# Altium schematic sheet Sheet3.SchDoc
size A4; SheetNumber: 3; SheetTotal: 3
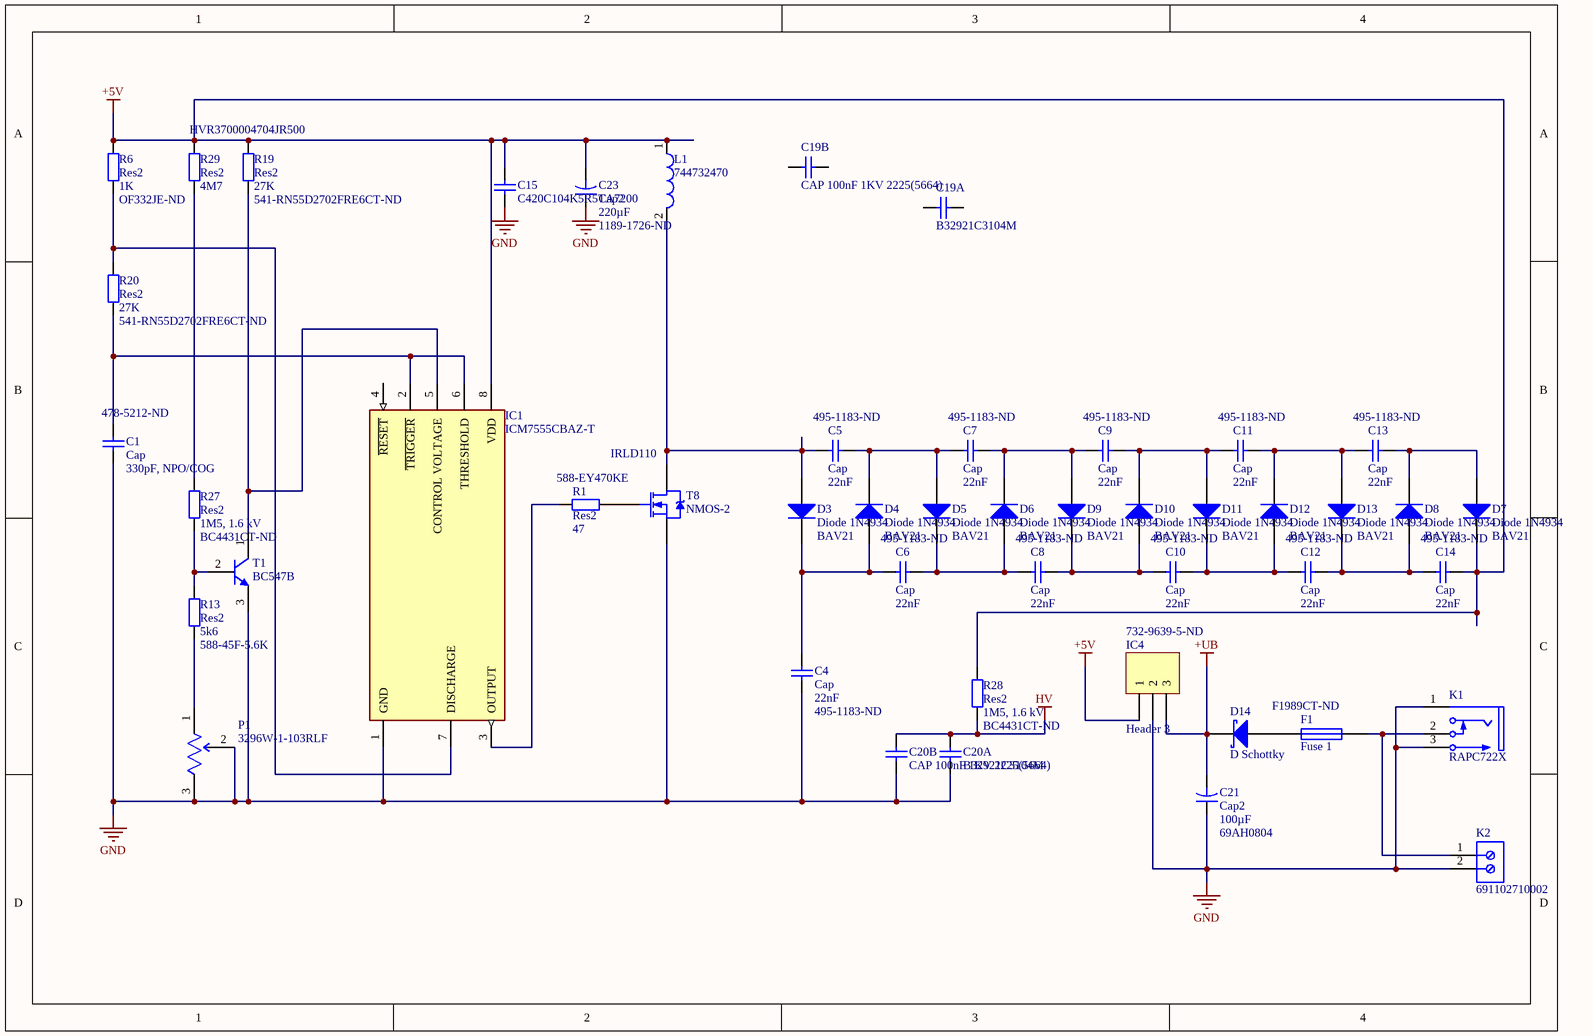
[diagram p0: Sheet3.SchDoc]

## Parts
C1  Cap  value 330pF, NPO/COG  Supplier Part Number 1: 478-5212-ND  [RAD-0.3]
C4  Cap  value 22nF  Supplier Part Number 1: 495-1183-ND  [RAD-0.3]
C5  Cap  value 22nF  Supplier Part Number 1: 495-1183-ND  [RAD-0.3]
C6  Cap  value 22nF  Supplier Part Number 1: 495-1183-ND  [RAD-0.3]
C7  Cap  value 22nF  Supplier Part Number 1: 495-1183-ND  [RAD-0.3]
C8  Cap  value 22nF  Supplier Part Number 1: 495-1183-ND  [RAD-0.3]
C9  Cap  value 22nF  Supplier Part Number 1: 495-1183-ND  [RAD-0.3]
C10  Cap  value 22nF  Supplier Part Number 1: 495-1183-ND  [RAD-0.3]
C11  Cap  value 22nF  Supplier Part Number 1: 495-1183-ND  [RAD-0.3]
C12  Cap  value 22nF  Supplier Part Number 1: 495-1183-ND  [RAD-0.3]
C13  Cap  value 22nF  Supplier Part Number 1: 495-1183-ND  [RAD-0.3]
C14  Cap  value 22nF  Supplier Part Number 1: 495-1183-ND  [RAD-0.3]
C15  C420C104K5R5TA7200  [KEMT-C420C104K5R5TA7200-2]
C19A  B32921C3104M  [TDK-B32921C3104M]
C19B  CAP 100nF 1KV 2225(5664)  [CAPC2225(5664)230_L]
C20A  B32921C3104M  [TDK-B32921C3104M]
C20B  CAP 100nF 1KV 2225(5664)  [CAPC2225(5664)230_L]
C21  Cap2  value 100µF  Supplier Part Number 1: 69AH0804  [CAPR5-4X5]
C23  Cap2  value 220µF  Supplier Part Number 1: 1189-1726-ND  [CAPR5-4X5]
D3  Diode 1N4934  Supplier Part Number 1: BAV21  [DO-41]
D4  Diode 1N4934  Supplier Part Number 1: BAV21  [DO-41]
D5  Diode 1N4934  Supplier Part Number 1: BAV21  [DO-41]
D6  Diode 1N4934  Supplier Part Number 1: BAV21  [DO-41]
D7  Diode 1N4934  Supplier Part Number 1: BAV21  [DO-41]
D8  Diode 1N4934  Supplier Part Number 1: BAV21  [DO-41]
D9  Diode 1N4934  Supplier Part Number 1: BAV21  [DO-41]
D10  Diode 1N4934  Supplier Part Number 1: BAV21  [DO-41]
D11  Diode 1N4934  Supplier Part Number 1: BAV21  [DO-41]
D12  Diode 1N4934  Supplier Part Number 1: BAV21  [DO-41]
D13  Diode 1N4934  Supplier Part Number 1: BAV21  [DO-41]
D14  D Schottky  [SMB]
F1  Fuse 1  Supplier Part Number 1: F1989CT-ND  [PIN-W2/E2.8]
IC1  ICM7555CBAZ-T  [FP-M8_15-MFG]
IC4  Header 3  Supplier Part Number 1: 732-9639-5-ND  [HDR1X3]
K1  RAPC722X  [SWITCH-RAPC712X-3_V]
K2  691102710002  [691102710002]
L1  744732470  [WE-TI-LM-STBG]
P1  3296W-1-103RLF  [FP-3296W-MFG]
R1  Res2  value 47  Supplier Part Number 1: 588-EY470KE  [AXIAL-0.4]
R6  Res2  value 1K  Supplier Part Number 1: OF332JE-ND  [AXIAL-0.4]
R13  Res2  value 5k6  Supplier Part Number 1: 588-45F-5.6K  [AXIAL-0.4]
R19  Res2  value 27K  Supplier Part Number 1: 541-RN55D2702FRE6CT-ND  [AXIAL-0.4]
R20  Res2  value 27K  Supplier Part Number 1: 541-RN55D2702FRE6CT-ND  [AXIAL-0.4]
R27  Res2  value 1M5, 1.6 kV  Supplier Part Number 1: BC4431CT-ND  [AXIAL-0.4]
R28  Res2  value 1M5, 1.6 kV  Supplier Part Number 1: BC4431CT-ND  [AXIAL-0.4]
R29  Res2  value 4M7  Supplier Part Number 1: HVR3700004704JR500  [AXIAL-0.4]
T1  BC547B  [ONSC-TO-92-3-29-11]
T8  NMOS-2  Supplier Part Number 1: IRLD110  [TO-220AB]

## Nets
+5V: C14.2 C15.2 C23.2 D7.2(K) IC1.8(VDD) IC4.1 L1.1 R6.1 R19.2 R28.2 R29.2
+UB: C21.2 D14.2(K) IC4.3
GND: C1.1 C4.1 C15.1 C20A.1 C20B.1 C21.1 C23.1 IC1.1(GND) IC4.2 K1.1 K1.3 K2.2 P1.2(WIPER) P1.3(CW) T1.3(E) T8.3(S)
HV: C20A.2 C20B.2 R28.1
NetC1_2: C1.2 IC1.2(~{TRIGGER}) IC1.6(THRESHOLD) R20.1
NetC4_2: C4.2 C6.1 D3.2(K) D4.1(A)
NetC5_1: C5.1 D3.1(A) L1.2 T8.2(D)
NetC5_2: C5.2 C7.1 D4.2(K) D5.1(A)
NetC6_2: C6.2 C8.1 D5.2(K) D6.1(A)
NetC7_2: C7.2 C9.1 D6.2(K) D9.1(A)
NetC8_2: C8.2 C10.1 D9.2(K) D10.1(A)
NetC9_2: C9.2 C11.1 D10.2(K) D11.1(A)
NetC10_2: C10.2 C12.1 D11.2(K) D12.1(A)
NetC11_2: C11.2 C13.1 D12.2(K) D13.1(A)
NetC12_2: C12.2 C14.1 D8.1(A) D13.2(K)
NetC13_2: C13.2 D7.1(A) D8.2(K)
NetD14_1: D14.1(A) F1.1
NetF1_2: F1.2 K1.2 K2.1
NetIC1_3: IC1.3(OUTPUT) R1.1
NetIC1_5: IC1.5(CONTROL_VOLTAGE) R19.1 T1.1(C)
NetIC1_7: IC1.7(DISCHARGE) R6.2 R20.2
NetP1_1: P1.1(CCW) R13.1
NetR1_2: R1.2 T8.1(G)
NetR13_2: R13.2 R27.1 T1.2(B)
NetR27_2: R27.2 R29.1

Not connected (* = marked no-connect by the designer): C19A 1 2; C19B 1 2; IC1 4(~{RESET})

## Library data of the parts
C1 = Cap: Multilayer Ceramic Capacitor, 330 pF, 100 V,  5%, Radial Leaded, C0G / NP0; Manufacturer: Kyocera AVX; Manufacturer Part Number: SR151A331JAR; Capacitance: 330pF; Voltage Rating: 100V; Voltage Rating (DC): 50V; Lead/Base Style: Straight; Temperature Coefficient: 30ppm/°C; Lead Diameter: 0.508mm; Published: 8-Jun-2000; LatestRevisionDate: 17-Jul-2002; LatestRevisionNote: Re-released for DXP Platform.; PackageReference: RAD-0.3; Publisher: Altium Limited; PackageDescription: Radial Cap, Thru-Hole; 2 Leads; 0.3 in Pin Spacing; Supplier 1: Digi-Key; RoHS: Yes; Category: Ceramic Capacitors; Stock 1: 1456; Pricing 1: 1=0,63000, 10=0,44200, 50=0,33420, 100=0,29110, 500=0,21560, 1000=0,18326, 2500=0,17248, 5000=0,16170 (USD); Mount: Through Hole,PCB; Case/Package: Dipped; Number of Pins: 2; Contact Plating: Tin,Matte; Min Operating Temperature: -55°C; Max Operating Temperature: 125°C; Tolerance: 5%; Packaging: Bulk; Dielectric: C0G; Termination: Radial; Package Quantity: 1000; Resistor Type: Ceramic; Voltage: 100V; Length: 3.81mm; Width: 0.1inch; Height: 3.81mm; Lead Pitch: 2.54mm; Thickness: 2.54mm; Depth: 2.54mm; Height - Seated (Max): 0.15inch; Radiation Hardening: No; RoHS Compliant: Yes; Lead Free: Lead Free; REACH SVHC: No SVHC; ComponentLink1URL: https://datasheet.ciiva.com/11787/0900766b8064818e-11787697.pdf?src-supplier=RSComponents; ComponentLink1Description: https://datasheet.ciiva.com/11787/0900766b8064818e-11787697.pdf?src-supplier=RSComponents; ComponentLink2URL: https://datasheet.ciiva.com/27051/1129391-27051478.pdf?src-supplier=Jameco; ComponentLink2Description: https://datasheet.ciiva.com/27051/1129391-27051478.pdf?src-supplier=Jameco; ComponentLink3URL: https://datasheet.ciiva.com/154/skycap-154577.pdf?src-supplier=Digi-Key; ComponentLink3Description: https://datasheet.ciiva.com/154/skycap-154577.pdf?src-supplier=Digi-Key; ComponentLink4URL: https://datasheet.ciiva.com/16391/skycap-sr-16391048.pdf?src-supplier=Future+Electronics; ComponentLink4Description: https://datasheet.ciiva.com/16391/skycap-sr-16391048.pdf?src-supplier=Future+Electronics; ComponentLink5URL: https://datasheet.ciiva.com/14587/70195658-14587500.pdf?src-supplier=Allied+Electronics; ComponentLink5Description: https://datasheet.ciiva.com/14587/70195658-14587500.pdf?src-supplier=Allied+Electronics; ComponentLink6URL: https://datasheet.ciiva.com/22620/210648-22620069.pdf?src-supplier=Element14; ComponentLink6Description: https://datasheet.ciiva.com/22620/210648-22620069.pdf?src-supplier=Element14; ComponentLink7URL: https://datasheet.ciiva.com/5389/skycap-sr-8826-5389254.pdf?src-supplier=Mouser; ComponentLink7Description: https://datasheet.ciiva.com/5389/skycap-sr-8826-5389254.pdf?src-supplier=Mouser
C4-C14 = Cap: Cap Film 0.022uF 250V PET 5% (7.2 X 2.5 X 6.5mm) Radial 5mm 125C Bulk; Manufacturer: TDK EPCOS; Manufacturer Part Number: B32529C3223J000; Lead Diameter: 0.5mm; Published: 8-Jun-2000; LatestRevisionDate: 17-Jul-2002; LatestRevisionNote: Re-released for DXP Platform.; PackageReference: RAD-0.3; Publisher: Altium Limited; PackageDescription: Radial Cap, Thru-Hole; 2 Leads; 0.3 in Pin Spacing; Supplier 1: Digi-Key; RoHS: Yes; Category: Film Capacitors; Stock 1: 7997; Pricing 1: 1=0,30000, 10=0,21000, 50=0,14720, 100=0,12610, 500=0,09460, 1000=0,07988, 2500=0,07568, 5000=0,07147 (USD); Mount: Through Hole; Case/Package: Radial; Contact Plating: Tin,Matte; Min Operating Temperature: -55°C; Max Operating Temperature: 125°C; Packaging: Bulk; Tolerance: 5%; Capacitance: 22nF; Dielectric: PET; Termination: Radial; Length: 7.2mm; Depth: 2.5mm; Lead Pitch: 5mm; RoHS Compliant: Yes; ComponentLink1URL: http://components.arrow.com/part/dataview/0323_02076122?src-supplier=Arrow+Europe; ComponentLink1Description: http://components.arrow.com/part/dataview/0323_02076122?src-supplier=Arrow+Europe; ComponentLink2URL: https://www.tdk-electronics.tdk.com/inf/20/20/db/fc_2009/B32520_529.pdf?src-supplier=Digi-Key; ComponentLink2Description: https://www.tdk-electronics.tdk.com/inf/20/20/db/fc_2009/B32520_529.pdf?src-supplier=Digi-Key; ComponentLink3URL: http://www.epcos.com/inf/20/20/db/fc_2009/MKT_B32520_529.pdf?src-supplier=Avnet; ComponentLink3Description: http://www.epcos.com/inf/20/20/db/fc_2009/MKT_B32520_529.pdf?src-supplier=Avnet
C15 = CMP-2000-05175-1: CAP, Ceramic, 0.1 uF, +/- 10%, 50 V, -55 to 125 degC, 2-Pin THD, RoHS, Tape and Reel; Manufacturer: KEMET; Capacitance Value: 0.1uF; Dielectric: X7R; Product Diameter: 2.54(Max)mm; Rad Hard: No; Product Length: 6.6(Max)mm; Voltage: 50Vdc; Tolerance: 10%; Package Description: 3-Pin Through Hole Device, Body 7.36 x 2.54 mm, Pitch 11.04 mm; Category: CapacitorCeramicMultilayer; Operating Temperature: -55to125degC; Termination Style: Axial; Manufacturer URL: http://www.kemet.com/; Mounting: ThroughHole; Datasheet URL: http://www.mouser.com/ds/2/212/Kemet_C410-412-420-364989.pdf; Package/Case: 2.54(Max)X6.6(Max); Datasheet Version: Aug-14
C19A C20A = CMP-2000-05890-1: EMI Suppression Capacitor (MKP), 0.1 uF, +/- 20%, 305 V, 2-Pin THD, RoHS, Bulk; Manufacturer: TDK; PCN Packaging: MKT,MKPTypeLaserMarking26/Apr/2013; Online Catalog: B32921C/D-B32928C/DSeries; Featured Product: FilmCapacitors; Product Training Modules: FilmCapacitorsCapacitorsforLEDApplicationsAutomotiveIndustryCapacitors; Catalog Drawings: Y(1,2),X(1,2)SeriesSide1Y(1,2),X(1,2)SeriesSide2; PCN Design/Specification: B32(5679)B333Series02/May/2014; Other Names: 495-2318B32921C3104M000B32921C3104MN1; Capacitance: 0.1µF; Voltage Rating - AC: 305V; Dielectric Material: Polypropylene(PP); Datasheet URL: https://en.tdk.eu/inf/20/20/db/fc_2009/X2_B32921_928.pdf; Package / Case: Radial; Operating Temperature: -40°C~110°C; Lead Spacing: 0.394"(10.00mm); Size / Dimension: 0.512"Lx0.236"W(13.00mmx6.00mm); Package Reference: B32921C3104M; Datasheet Version: 09/2016; Features: X2SafetyRated; Standard Package: 1,000; Category: Capacitors; Package Description: 2-Pin Through Hole Device, Body 13 x 6 mm, Pitch 10 mm; Family: FilmCapacitors; ESR (Equivalent Series Resistance): -; Voltage Rating - DC: -; Termination: PCPins; Packaging: Bulk; Mounting Type: ThroughHole; Height - Seated (Max): 0.472"(12.00mm); Mounting Technology: ThroughHole; Manufacturer URL: http://www.tdk.com/; Applications: EMI,RFISuppression; Tolerance: ±20%; Series: B32921
C19B C20B = CMP-1043-00700-1: CAP 100nF 1KV ±10% 2225 (5664 Metric) Thickness 2.2mm SMD; Tolerance: Â±10%; Case-EIA: 2225; Case-Metric: 5664; Value: 100nF; Max Thickness: 2.2 mm; Technology: SMT; Rated Voltage: 1K V
C21 = Cap2: Cap Aluminum 100uF 25V 20% (6.3 X 11mm) Radial 5mm 190mA 2500 hr 85C Ammo Pack; Manufacturer: Vishay BCcomponents; Manufacturer Part Number: MAL203836101E3; Life (Hours): 2500Hour; Leakage Current: 25uA; Dissipation Factor: 0.14%; Lead Diameter: 0.5mm; Published: 23-Sep-2002; PackageReference: CAPR5-4X5; Publisher: Altium Limited; PackageDescription: Capacitor; 2 Leads; Supplier 1: Newark; RoHS: Yes; Category: Aluminum Electrolytic Capacitors; Stock 1: 9020; Pricing 1: 10=0,22900, 25=0,22100, 50=0,21300, 100=0,20400 (USD); Mount: Through Hole; Case/Package: Radial; Weight: 0.021164oz; Min Operating Temperature: -40°C; Max Operating Temperature: 85°C; Capacitance: 100uF; Tolerance: 20%; Voltage Rating: 25V; Packaging: Tape and Reel; Ripple Current: 190mA; Termination: Radial; Package Quantity: 10000; Voltage Rating (DC): 25V; Series: 038 RSU; Diameter: 6.3mm; Length: 11mm; Height: 11mm; Height - Seated (Max): 0.492inch; Lead Pitch: 5mm; Radiation Hardening: No; RoHS Compliant: Yes; ComponentLink1URL: https://datasheet.ciiva.com/11701/038rsu-11701167.pdf?src-supplier=Avnet; ComponentLink1Description: https://datasheet.ciiva.com/11701/038rsu-11701167.pdf?src-supplier=Avnet
C23 = Cap2: Rubycon Aluminium Electrolytic Capacitor 220F 16 V dc 6.3mm Through Hole series ZLH lifetime 6000h; Manufacturer Part Number: 16ZLH220MEFC6.3X11; Capacitance: 220uF; Tolerance: 20%; Voltage Rating: 16V; Ripple Current: 540mA; Life (Hours): 6000Hour; Leakage Current: 3uA; Impedance: 94mR; Lead Diameter: 0.5mm; Published: 23-Sep-2002; PackageReference: CAPR5-4X5; Publisher: Altium Limited; PackageDescription: Capacitor; 2 Leads; Supplier 1: Digi-Key; Manufacturer: Rubycon; RoHS: Yes; Category: Aluminum Electrolytic Capacitors; Stock 1: 7286; Pricing 1: 1=0,32000, 10=0,21700, 50=0,14480, 100=0,12320, 500=0,08694, 1000=0,07607, 2500=0,07245, 5000=0,06702 (USD); Mount: Through Hole; Case/Package: Radial; Number of Pins: 2; Dielectric Material: Aluminium; Min Operating Temperature: -40°C; Max Operating Temperature: 105°C; Packaging: Bulk; Package Quantity: 2000; Voltage Rating (DC): 16V; Termination: Radial; Series: ZLH; Voltage: 16V; Construction: RADIAL; Ripple Current (AC): 540mA; Diameter: 6.3mm; Height: 11mm; Lead Pitch: 2.5mm; Height - Seated (Max): 0.492inch; Radiation Hardening: No; RoHS Compliant: Yes; REACH SVHC: No SVHC; ComponentLink1URL: https://datasheet.ciiva.com/11778/0900766b80e2f602-11778004.pdf?src-supplier=RSComponents; ComponentLink1Description: https://datasheet.ciiva.com/11778/0900766b80e2f602-11778004.pdf?src-supplier=RSComponents; ComponentLink2URL: https://datasheet.ciiva.com/11692/e-zlh-11692183.pdf?src-supplier=Avnet; ComponentLink2Description: https://datasheet.ciiva.com/11692/e-zlh-11692183.pdf?src-supplier=Avnet; ComponentLink3URL: https://datasheet.ciiva.com/6317/e-zlh-6317161.pdf?src-supplier=Digi-Key; ComponentLink3Description: https://datasheet.ciiva.com/6317/e-zlh-6317161.pdf?src-supplier=Digi-Key; ComponentLink4URL: https://datasheet.ciiva.com/1455/1758712-1455435.pdf?src-supplier=Element14; ComponentLink4Description: https://datasheet.ciiva.com/1455/1758712-1455435.pdf?src-supplier=Element14; ComponentLink5URL: https://datasheet.ciiva.com/17514/e-zlh-17514781.pdf?src-supplier=Avnet+Europe; ComponentLink5Description: https://datasheet.ciiva.com/17514/e-zlh-17514781.pdf?src-supplier=Avnet+Europe
D3-D13 = Diode 1N4934: DIODE, SMALL SIGNAL, DO-35; Manufacturer: NXP Semiconductors; Element Configuration: Single; Reverse Recovery Time: 50ns; Forward Voltage: 1.25V; Max Repetitive Reverse Voltage (Vrrm): 250V; Forward Current: 250mA; Max Forward Surge Current (Ifsm): 1A; Current Rating: 200mA; Polarity: Standard; Capacitance: 5pF; Published: 8-Jun-2000; LatestRevisionDate: 17-Jul-2002; LatestRevisionNote: Re-released for DXP Platform.; DatasheetVersion: 1999; PackageVersion: Aug-1999; PackageReference: DO-41; Publisher: Altium Limited; PackageDescription: Diode, Axial; Body 5.2 x 2.7 mm (LxDia. max), Lead Dia. 0.86 mm (max); Code_JEDEC: DO-204-AL; ComponentLink1Description: Manufacturer Link; ComponentLink1URL: http://www.fairchildsemi.com/; ComponentLink2Description: Datasheet; ComponentLink2URL: http://www.fairchildsemi.com/ds/1N%2F1N4934.pdf; Supplier 1: Avnet; Manufacturer Part Number: BAV21; RoHS: Yes; Category: Rectifier Diodes; Stock 1: 745; Case/Package: DO-204AH; Number of Pins: 2; Max Operating Temperature: 175°C; Packaging: Bulk; Voltage Rating (DC): 250V; Output Current: 200mA; Lead Free: Lead Free; REACH SVHC: No SVHC; RoHS Compliant: Yes
D14 = D Schottky: Schottky Diode; Published: 8-Jun-2000; LatestRevisionDate: 17-Jul-2002; LatestRevisionNote: Re-released for DXP Platform.; PackageReference: SMB; Publisher: Altium Limited; PackageDescription: DO-214-AA/SMB; 2 C-Bend Leads; Body 5.3 x 3.6 mm, inc. leads (LxW); Code_JEDEC: DO-214-AA
F1 = Fuse 1: PTC Resettable Fuse 0.5A(hold) 1A(trip) 60VDC 40A 0.77W 4s 0.5Ohm Radial 7.9 X 3.1mm Ammo Pack; Manufacturer: Littelfuse; Manufacturer Part Number: 60R050XPR; Resistance: 1.17R; Max Voltage Rating (DC): 60V; Power Dissipation: 770mW; Hold Current: 500mA; Approvals: cULus,TUV; Published: 8-Jun-2000; LatestRevisionDate: 17-Jul-2002; LatestRevisionNote: Re-released for DXP Platform.; PackageReference: PIN-W2/E2.8; Publisher: Altium Limited; PackageDescription: Thru-Hole; 2 Leads; Supplier 1: Digi-Key; RoHS: Yes; Category: PTC Resettable Fuses; Stock 1: 1853; Pricing 1: 1=0,53000, 5=0,51400, 10=0,49700, 50=0,41840, 100=0,34740, 250=0,31580, 500=0,26844, 1000=0,23685 (USD); Case/Package: Radial; Min Operating Temperature: -40°C; Max Operating Temperature: 85°C; Current Rating: 40A; Max Current Rating: 40A; Package Quantity: 2000; Packaging: Tape and Reel; Termination: Radial; Working Voltage: 60V; Voltage Rating (DC): 60V; Operating Supply Voltage: 60V; Trip Current: 1A; Time to Trip: 4s; Series: POLY-FUSE®, 60R; Width: 7.62mm; Height: 13.7mm; Lead Pitch: 5.1mm; Thickness: 3.05mm; Size: 3.1mm; REACH SVHC: Unknown; Lead Free: Lead Free; RoHS Compliant: Yes; ComponentLink1URL: https://datasheet.ciiva.com/16393/littelfuse-60r-16393256.pdf?src-supplier=Future+Electronics; ComponentLink1Description: https://datasheet.ciiva.com/16393/littelfuse-60r-16393256.pdf?src-supplier=Future+Electronics; ComponentLink2URL: https://datasheet.ciiva.com/325/littelfuse-60r-325835.pdf?src-supplier=Digi-Key; ComponentLink2Description: https://datasheet.ciiva.com/325/littelfuse-60r-325835.pdf?src-supplier=Digi-Key; ComponentLink3URL: https://datasheet.ciiva.com/325/littelfuse-60r-325836.pdf?src-supplier=Digi-Key; ComponentLink3Description: https://datasheet.ciiva.com/325/littelfuse-60r-325836.pdf?src-supplier=Digi-Key; ComponentLink4URL: https://datasheet.ciiva.com/14119/iewickmann-resettables-rld60-en-14119741.pdf?src-supplier=Distrelec; ComponentLink4Description: https://datasheet.ciiva.com/14119/iewickmann-resettables-rld60-en-14119741.pdf?src-supplier=Distrelec; ComponentLink5URL: https://datasheet.ciiva.com/46430/692303-46430109.pdf?src-supplier=Element14; ComponentLink5Description: https://datasheet.ciiva.com/46430/692303-46430109.pdf?src-supplier=Element14
IC1 = CMP-13501-000001-1: IC OSC SINGLE TIMER 1MHZ 8-SOIC
IC4 = Header 3: WURTH ELEKTRONIK - 173010578 - DC/DC Converter, ITE & General, 1 Output, 5 W, 5 V, 1 A, FDSM Series; Manufacturer: Wurth Electronics; Number of Outputs: 1; Min Input Voltage: 7V; Max Input Voltage: 28V; Voltage - Output 1: 5V; Max Output Current: 1A; Efficiency: 91%; Switching Frequency: 300kHz; Max Power Dissipation: 5W; LatestRevisionDate: 17-Jul-2002; LatestRevisionNote: Re-released for DXP Platform.; Publisher: Altium Limited; Supplier 1: Digi-Key; Manufacturer Part Number: 173010578; RoHS: Yes; Category: Board Mount Modules; Stock 1: 316; Pricing 1: 1=7,36000 (USD); Mount: Through Hole; Case/Package: Module; Number of Pins: 3; Min Operating Temperature: -40°C; Max Operating Temperature: 85°C; Packaging: Rail/Tube; Output Current: 1A; Nominal Output Voltage: 5V; Features: OVP,OCP,OTP,SCP; Length: 0.46inch; Width: 0.33inch; Height: 0.41inch; REACH SVHC: Unknown; RoHS Compliant: Yes; ComponentLink1URL: http://www.farnell.com/datasheets/2061786.pdf?src-supplier=Farnell; ComponentLink1Description: http://www.farnell.com/datasheets/2061786.pdf?src-supplier=Farnell; ComponentLink2URL: http://www.farnell.com/datasheets/2061786.pdf?src-supplier=Element14; ComponentLink2Description: http://www.farnell.com/datasheets/2061786.pdf?src-supplier=Element14; ComponentLink3URL: https://katalog.we-online.de/pm/datasheet/173010578.pdf?src-supplier=Digi-Key; ComponentLink3Description: https://katalog.we-online.de/pm/datasheet/173010578.pdf?src-supplier=Digi-Key; ComponentLink4URL: http://www.farnell.com/datasheets/2061786.pdf?src-supplier=Newark; ComponentLink4Description: http://www.farnell.com/datasheets/2061786.pdf?src-supplier=Newark
K1 = CMP-2000-05384-1: Power Jack, 5 A, 3-Pin THD, RoHS, Bulk; Manufacturer: Switchcraft; Current Rating: 5A; Plug/Mating Plug Diameter: 2.1mmID,5.5mmOD; Gender: Male; Mating Products: S765-ND / -CONNPLUGMINIPWR2CONDWHT/RED / S760K-ND / -CONNPOWERPLUGMINI.08"BLACK / SC1052-ND / -CONNPOWERPLUGMINIBLACK; Number of Positions/Contacts: 2Conductors,2Contacts; Internal Switch(s): SingleSwitch,NormallyClosed; Shielding: Unshielded; Catalog Drawings: RAPC7(1,2)2XSide / RAPC7(1,2)2XTop; Dynamic Catalog: SwitchcraftInc; Other Names: Q2287470A / RAPC722X-ND / SC1313; Standard Package: 2,500; Termination: SolderEyelet(s); Family: Barrel-PowerConnectors; Housing Color: Black; Housing Material: Thermoplastic; RoHS Information: SwitchcraftRoHSInfo; Color: Black; Contact Material - Plating: Nickel; Mounting Type: ThroughHole,RightAngle; Manufacturer URL: http://www.switchcraft.com/; Contact Material: Brass; Datasheet Version: Rev. A, 08/2005; Connector Type: Jack; Category: Connectors,Interconnects; Datasheet URL: http://www.mouser.com/ds/2/393/rapc722x_cd-371352.pdf
K2 = CMP-1502-03258-1: Series 102 - 5.00 mm Horizontal Entry Modular with Pressure Clamp WR-TBL, 2 pin; Manufacturer: Wurth Elektronik; Pin Number: 2; Pitch: 5.00mm; Manufacturer URL: http://www.we-online.de; Mounting Technology: THT; Publisher: WurthElektronik; Packaging: Box; Package Reference: 691102710002; Datasheet URL: http://katalog.we-online.de/em/datasheet/6911027100xx.pdf; Operating Temperature: -40to105degC; Part Number: 691102710002
L1 = CMP-0225-00013-1: Radial Leaded Wire Wound Inductor WE-TI, L = 47.0 µH; Inductance: 47.0 ÂµH; ComponentLink2Description: Datasheet; PackageReference: WE-TI-LM-STBG; PackageVersion: 2010; ComponentLink2URL: http://www.we-online.de/katalog/media/pdf/744732470.pdf; ComponentLink1URL: http://www.we-online.com; DatasheetVersion: ver 2, Jan-2010; PackageDescription: THT Inductor, 2-Leads, Body 9.5 x 9.5 mm; ComponentLink1Description: Manufacturer Link
P1 = CMP-07234-000024-1: TRIMMER 10K OHM 0.5W PC PIN TOP; Resistance: 10kR; Temperature Coefficient: 100ppm/°C; Power Rating: 500mW; Tolerance: 10%; Number of Turns: 25; Width: 0.19inch; Termination: Pin; Radiation Hardening: No; Contact Plating: Tin; Composition: Cermet; Length: 9.53mm; Height: 0.395inch; Depth: 4.83mm; REACH SVHC: No SVHC; Weight: 0.03oz; Min Operating Temperature: -55°C; Military Standard: Not; Max Operating Temperature: 125°C; Packaging: Tape and Reel; Package Quantity: 1; Taper: Linear; Max Power Dissipation: 500mW; Mount: Through Hole
R1 = Res2: RES, CERAMIC, 47OHM, 2.5W, 10%, AXIAL; Product Range:OHMITE - EY Series; Resistance:47ohm; Power Rating:2.5W; Resistance Tolerance:± 10%; Resistor Case Style:Axial Leaded; Resistor Element Material:Ceramic; Temperature ;RoHS Compliant: Yes; Manufacturer: Ohmite; Manufacturer Part Number: EY470KE; Resistance: 47R; Temperature Coefficient: 300ppm/°C; Voltage Rating: 550V; Lead Diameter: 1mm; Published: 8-Jun-2000; LatestRevisionDate: 17-Jul-2002; LatestRevisionNote: Re-released for DXP Platform.; PackageReference: AXIAL-0.4; Publisher: Altium Limited; PackageDescription: Axial Device, Thru-Hole; 2 Leads; 0.4 in Pin Spacing; Supplier 1: Mouser; RoHS: Yes; Category: Through-Hole Resistors; Stock 1: 99; Pricing 1: 1=5,01000, 10=4,47000, 50=3,84000, 100=3,31000, 1000=2,28000, 10000=2,25000 (USD); Mount: Through Hole; Case/Package: Axial; Min Operating Temperature: -40°C; Max Operating Temperature: 110°C; Power Rating: 2.5W; Tolerance: 10%; Resistor Type: Ceramic; Packaging: Bulk; Number of Terminations: 2; Termination: Axial; Package Quantity: 25; Max Power Dissipation: 2.5W; Features: Moisture Resistant; Diameter: 9.4mm; Length: 1.819inch; RoHS Compliant: Yes; REACH SVHC: Unknown; ComponentLink1URL: https://datasheet.ciiva.com/29653/res-ey-29653422.pdf?src-supplier=Digi-Key; ComponentLink1Description: https://datasheet.ciiva.com/29653/res-ey-29653422.pdf?src-supplier=Digi-Key; ComponentLink2URL: https://datasheet.ciiva.com/46422/1812108-46422284.pdf?src-supplier=Element14; ComponentLink2Description: https://datasheet.ciiva.com/46422/1812108-46422284.pdf?src-supplier=Element14; ComponentLink3URL: https://datasheet.ciiva.com/46641/70356302-46641404.pdf?src-supplier=Allied+Electronics; ComponentLink3Description: https://datasheet.ciiva.com/46641/70356302-46641404.pdf?src-supplier=Allied+Electronics; ComponentLink4URL: https://datasheet.ciiva.com/46439/1812108-46439885.pdf?src-supplier=Element14; ComponentLink4Description: https://datasheet.ciiva.com/46439/1812108-46439885.pdf?src-supplier=Element14
R6 = Res2: Resistor;  Carbon Composition;  Res 3.3 Kilohms;  Pwr-Rtg 0.5 W;  Tol 5%;  Axial; Manufacturer: Ohmite; Manufacturer Part Number: OF332JE; Resistance: 3.3kR; Power Rating: 500mW; Voltage Rating: 350V; Lead Diameter: 0.7mm; Lead Length: 34.3mm; Wire/Cable Diameter: 0.029inch; Published: 8-Jun-2000; LatestRevisionDate: 17-Jul-2002; LatestRevisionNote: Re-released for DXP Platform.; PackageReference: AXIAL-0.4; Publisher: Altium Limited; PackageDescription: Axial Device, Thru-Hole; 2 Leads; 0.4 in Pin Spacing; Supplier 1: Digi-Key; RoHS: Yes; Category: Through-Hole Resistors; Stock 1: 864; Pricing 1: 1=0,94000, 10=0,83700, 25=0,76960, 50=0,70200, 100=0,60750, 250=0,51300, 500=0,43200, 1000=0,35910 (USD); Mount: Through Hole; Case/Package: Axial; Number of Pins: 2; Min Operating Temperature: -70°C; Max Operating Temperature: 130°C; Package Quantity: 100; Packaging: Bulk; Tolerance: 5%; Resistor Type: Carbon Composition; Number of Terminations: 2; Termination: Axial; Max Power Dissipation: 500mW; Voltage Rating (DC): 350V; Diameter: 3.8mm; Length: 10.3mm; Lead Pitch: 0.7mm; RoHS Compliant: Yes; REACH SVHC: Unknown; Lead Free: Lead Free; ComponentLink1URL: https://datasheet.ciiva.com/2757/res-od-of-oa-2757185.pdf?src-supplier=Digi-Key; ComponentLink1Description: https://datasheet.ciiva.com/2757/res-od-of-oa-2757185.pdf?src-supplier=Digi-Key; ComponentLink2URL: https://datasheet.ciiva.com/15782/little-demon-15782747.pdf?src-supplier=Onlinecomponents.com; ComponentLink2Description: https://datasheet.ciiva.com/15782/little-demon-15782747.pdf?src-supplier=Onlinecomponents.com; ComponentLink3URL: https://datasheet.ciiva.com/46422/1579394-46422350.pdf?src-supplier=Element14; ComponentLink3Description: https://datasheet.ciiva.com/46422/1579394-46422350.pdf?src-supplier=Element14; ComponentLink4URL: https://datasheet.ciiva.com/16719/70022143-16719455.pdf?src-supplier=Allied+Electronics; ComponentLink4Description: https://datasheet.ciiva.com/16719/70022143-16719455.pdf?src-supplier=Allied+Electronics
R13 = Res2: RES 5.6K OHM 5W 1% AXIAL; Manufacturer: Ohmite; Manufacturer Part Number: 45F5K6; Resistance: 5.6kR; Temperature Coefficient: 20ppm/°C; Voltage Rating: 460V; Published: 8-Jun-2000; LatestRevisionDate: 17-Jul-2002; LatestRevisionNote: Re-released for DXP Platform.; PackageReference: AXIAL-0.4; Publisher: Altium Limited; PackageDescription: Axial Device, Thru-Hole; 2 Leads; 0.4 in Pin Spacing; Supplier 1: Mouser; RoHS: No; Category: Through-Hole Resistors; Stock 1: 75; Pricing 1: 1=2,11000, 10=1,97000, 50=1,67000, 100=1,51000, 1000=0,88900, 10000=0,86200 (USD); Mount: Through Hole; Case/Package: Axial; Min Operating Temperature: 25°C; Max Operating Temperature: 275°C; Tolerance: 1%; Packaging: Bulk; Resistor Type: Wirewound; Number of Terminations: 2; Max Power Dissipation: 5W; Package Quantity: 25; Power Rating: 5W; Termination: Axial; Diameter: 8.7mm; Length: 0.937inch; ComponentLink1URL: https://datasheet.ciiva.com/2760/res-40-2760770.pdf?src-supplier=Digi-Key; ComponentLink1Description: https://datasheet.ciiva.com/2760/res-40-2760770.pdf?src-supplier=Digi-Key; ComponentLink2URL: https://datasheet.ciiva.com/5639/40-series-5639550.pdf?src-supplier=Mouser; ComponentLink2Description: https://datasheet.ciiva.com/5639/40-series-5639550.pdf?src-supplier=Mouser
R19 R20 = Res2: RES 27K OHM 1/8W 1% AXIAL; Manufacturer: Vishay Dale; Manufacturer Part Number: RN55D2702FRE6; Resistance: 27kR; Max Power Dissipation: 125mW; Temperature Coefficient: 100ppm/°C; Voltage Rating: 200V; Lead Diameter: 0.64mm; Published: 8-Jun-2000; LatestRevisionDate: 17-Jul-2002; LatestRevisionNote: Re-released for DXP Platform.; PackageReference: AXIAL-0.4; Publisher: Altium Limited; PackageDescription: Axial Device, Thru-Hole; 2 Leads; 0.4 in Pin Spacing; Supplier 1: Digi-Key; RoHS: No; Category: Through-Hole Resistors; Stock 1: 127; Pricing 1: 1=0,53000, 10=0,40700, 25=0,30960, 50=0,23000, 100=0,17110, 250=0,14456, 500=0,12390 (USD); Case/Package: Axial; Min Operating Temperature: -65°C; Max Operating Temperature: 175°C; Tolerance: 1%; Resistor Type: Metal Film; Packaging: Tape and Reel; Number of Terminations: 2; Package Quantity: 1000; Power Rating: 125mW; Features: Moisture Resistant,Military,Flame Retardant Coating; Series: Military, MIL-R-10509/7, RN55; Termination: Axial; Length: 0.24inch; Width: 2.29mm; RoHS Compliant: No; Lead Free: Contains Lead; ComponentLink1URL: https://datasheet.ciiva.com/14071/cmfmil-14071638.pdf?src-supplier=Digi-Key; ComponentLink1Description: https://datasheet.ciiva.com/14071/cmfmil-14071638.pdf?src-supplier=Digi-Key
R27 R28 = Res2: VISHAY - HVR2500001504JA100 - MOTSTÅND, 1M5; Manufacturer: Vishay BCcomponents; Voltage Rating: 1.6kV; Resistance: 1.5MR; Tolerance: 5%; Power Rating: 250mW; Temperature Coefficient: 250ppm/°C; Lead Length: 26mm; Published: 8-Jun-2000; LatestRevisionDate: 17-Jul-2002; LatestRevisionNote: Re-released for DXP Platform.; PackageReference: AXIAL-0.4; Publisher: Altium Limited; PackageDescription: Axial Device, Thru-Hole; 2 Leads; 0.4 in Pin Spacing; Supplier 1: Digi-Key; Manufacturer Part Number: HVR2500001504JA100; RoHS: Yes; Category: Through-Hole Resistors; Stock 1: 2978; Pricing 1: 1=0,45000, 10=0,32200, 25=0,23760, 50=0,17540, 100=0,12870, 250=0,10632, 500=0,08766 (USD); Case/Package: Conformal; Min Operating Temperature: -55°C; Max Operating Temperature: 155°C; Resistor Type: Metal Film; Termination: Axial; Construction: Cylindrical; Resistance Tolerance: 5%; Length: 7.5mm; REACH SVHC: Unknown; Military Standard: Not; RoHS Compliant: Yes; ComponentLink1URL: http://www.farnell.com/datasheets/2045737.pdf?src-supplier=Farnell; ComponentLink1Description: http://www.farnell.com/datasheets/2045737.pdf?src-supplier=Farnell; ComponentLink2URL: http://components.arrow.com/part/dataview/0323_04158699?src-supplier=Arrow+Europe; ComponentLink2Description: http://components.arrow.com/part/dataview/0323_04158699?src-supplier=Arrow+Europe; ComponentLink3URL: http://www.farnell.com/datasheets/2045737.pdf?src-supplier=Element14; ComponentLink3Description: http://www.farnell.com/datasheets/2045737.pdf?src-supplier=Element14; ComponentLink4URL: http://www.vishay.com/docs/30260/hvr2537.pdf?src-supplier=Digi-Key; ComponentLink4Description: http://www.vishay.com/docs/30260/hvr2537.pdf?src-supplier=Digi-Key; ComponentLink5URL: http://www.farnell.com/datasheets/2045737.pdf?src-supplier=Newark; ComponentLink5Description: http://www.farnell.com/datasheets/2045737.pdf?src-supplier=Newark
R29 = Res2: RES 4.7M OHM 1/2W 5% AXIAL; Manufacturer: Vishay BCcomponents; Resistance: 4.7MR; Max Power Dissipation: 500mW; Temperature Coefficient: 200ppm/°C; Voltage Rating: 3.5kV; Published: 8-Jun-2000; LatestRevisionDate: 17-Jul-2002; LatestRevisionNote: Re-released for DXP Platform.; PackageReference: AXIAL-0.4; Publisher: Altium Limited; PackageDescription: Axial Device, Thru-Hole; 2 Leads; 0.4 in Pin Spacing; Supplier 1: Arrow Electronics; Manufacturer Part Number: HVR3700004704JR500; RoHS: Yes; Category: Through-Hole Resistors; Stock 1: 1607; Pricing 1: 1=0,55200, 10=0,42080, 25=0,31700, 50=0,23310, 100=0,17160, 250=0,14340, 500=0,12170, 1000=0,09170, 5000=0,07430, 1=0,25800, 10=0,19670, 25=0,14820, 100=0,08110, 250=0,08040, 500=0,07960, 1000=0,07890 (USD); Case/Package: Axial; Number of Pins: 2; Min Operating Temperature: -55°C; Max Operating Temperature: 155°C; Tolerance: 5%; Resistor Type: Metal Film; Packaging: Tape and Reel; Number of Terminations: 2; Series: HVR37; Package Quantity: 1; Power Rating: 500mW; Voltage Rating (DC): 3.5kV; Features: Flame Retardant Coating; Resistance Tolerance: 5%; Length: 0.394inch; RoHS Compliant: Yes; REACH SVHC: Unknown; Lead Free: Lead Free; ComponentLink1URL: https://datasheet.ciiva.com/2711/hvr2537-2711956.pdf?src-supplier=Digi-Key; ComponentLink1Description: https://datasheet.ciiva.com/2711/hvr2537-2711956.pdf?src-supplier=Digi-Key; ComponentLink2URL: https://datasheet.ciiva.com/2711/hvr2537-2711957.pdf?src-supplier=Digi-Key; ComponentLink2Description: https://datasheet.ciiva.com/2711/hvr2537-2711957.pdf?src-supplier=Digi-Key; ComponentLink3URL: https://datasheet.ciiva.com/7836/653840-7836134.pdf?src-supplier=Element14; ComponentLink3Description: https://datasheet.ciiva.com/7836/653840-7836134.pdf?src-supplier=Element14
T1 = CMP-1048-01467-1: Amplifier Transistor, NPN Silicon, 3-Pin TO-92, Bulk Box; Manufacturer: On Semiconductor; IC Continuous (A): 0.1; fT Min (MHz): 150; DatasheetVersion: Rev. 7; ComponentLink1URL: http://www.onsemi.com/; Polarity: NPN; RoHS: FALSE; ComponentLink1Description: Manufacturer URL; Packing: Bulk Box; PackageDescription: 3-Pin Transistor Outline, Body 4.825 x 3.685 mm, Pitch 1.27 mm; ComponentLink3URL: http://www.onsemi.cn/pub_link/Collateral/2N6426-D.PDF; ComponentLink2Description: Datasheet; PackageVersion: Rev. AM; PackageReference: TO-92-3-29-11_AM_SL; ComponentLink3Description: Package Specification; Mounting Technology: Through Hole; PartNumber: BC547B; ComponentLink2URL: http://www.onsemi.com/pub_link/Collateral/BC546-D.PDF
T8 = NMOS-2: MOSFET N-CH 100V 1A 4-DIP; Manufacturer: Vishay Siliconix; Note: Pin 2 is electrically connected to pin 4.; Rise Time: 47ns; Max Power Dissipation: 1.3W; Drain to Source Resistance: 540mR; Gate to Source Voltage (Vgs): 10V; Turn-Off Delay Time: 16ns; Turn-On Delay Time: 9.3ns; Input Capacitance: 250pF; Number of Channels: 1; Published: 8-Jun-2000; LatestRevisionDate: 17-Jul-2002; LatestRevisionNote: Re-released for DXP Platform.; DatasheetVersion: PD-9.814; PackageVersion: Feb-1997; PackageReference: TO-220AB; Publisher: Altium Limited; PackageDescription: TO, Thru-Hole, Vertical, Heatsink Mounted; 3 In-Line Leads; Pitch 2.54 mm; ComponentLink1Description: Manufacturer Link; ComponentLink1URL: http://www.irf.com/; Supplier 1: Avnet; Manufacturer Part Number: IRLD110; RoHS: No; Category: MOSFETs; Mount: Through Hole; Case/Package: DIP; Number of Pins: 4; Min Operating Temperature: -55°C; Max Operating Temperature: 150°C; Packaging: Rail/Tube; Continuous Drain Current (ID): 1A; Drain to Source Breakdown Voltage: 100V; Package Quantity: 2500; Drain to Source Voltage (Vdss): 100V; Fall Time: 47ns; Rds On Max: 540mR; Length: 5mm; Width: 6.29mm; Height: 3.37mm; ComponentLink2URL: https://datasheet.ciiva.com/6370/sihld110-6370586.pdf?src-supplier=Digi-Key; ComponentLink2Description: https://datasheet.ciiva.com/6370/sihld110-6370586.pdf?src-supplier=Digi-Key; ComponentLink3URL: https://datasheet.ciiva.com/26137/sihld110-26137387.pdf?src-supplier=Avnet+Europe; ComponentLink3Description: https://datasheet.ciiva.com/26137/sihld110-26137387.pdf?src-supplier=Avnet+Europe; ComponentLink4URL: https://datasheet.ciiva.com/8116/sihld110-8116751.pdf?src-supplier=Avnet; ComponentLink4Description: https://datasheet.ciiva.com/8116/sihld110-8116751.pdf?src-supplier=Avnet